# Altium project USB-C_Horizontal_Bridge.PrjPcb
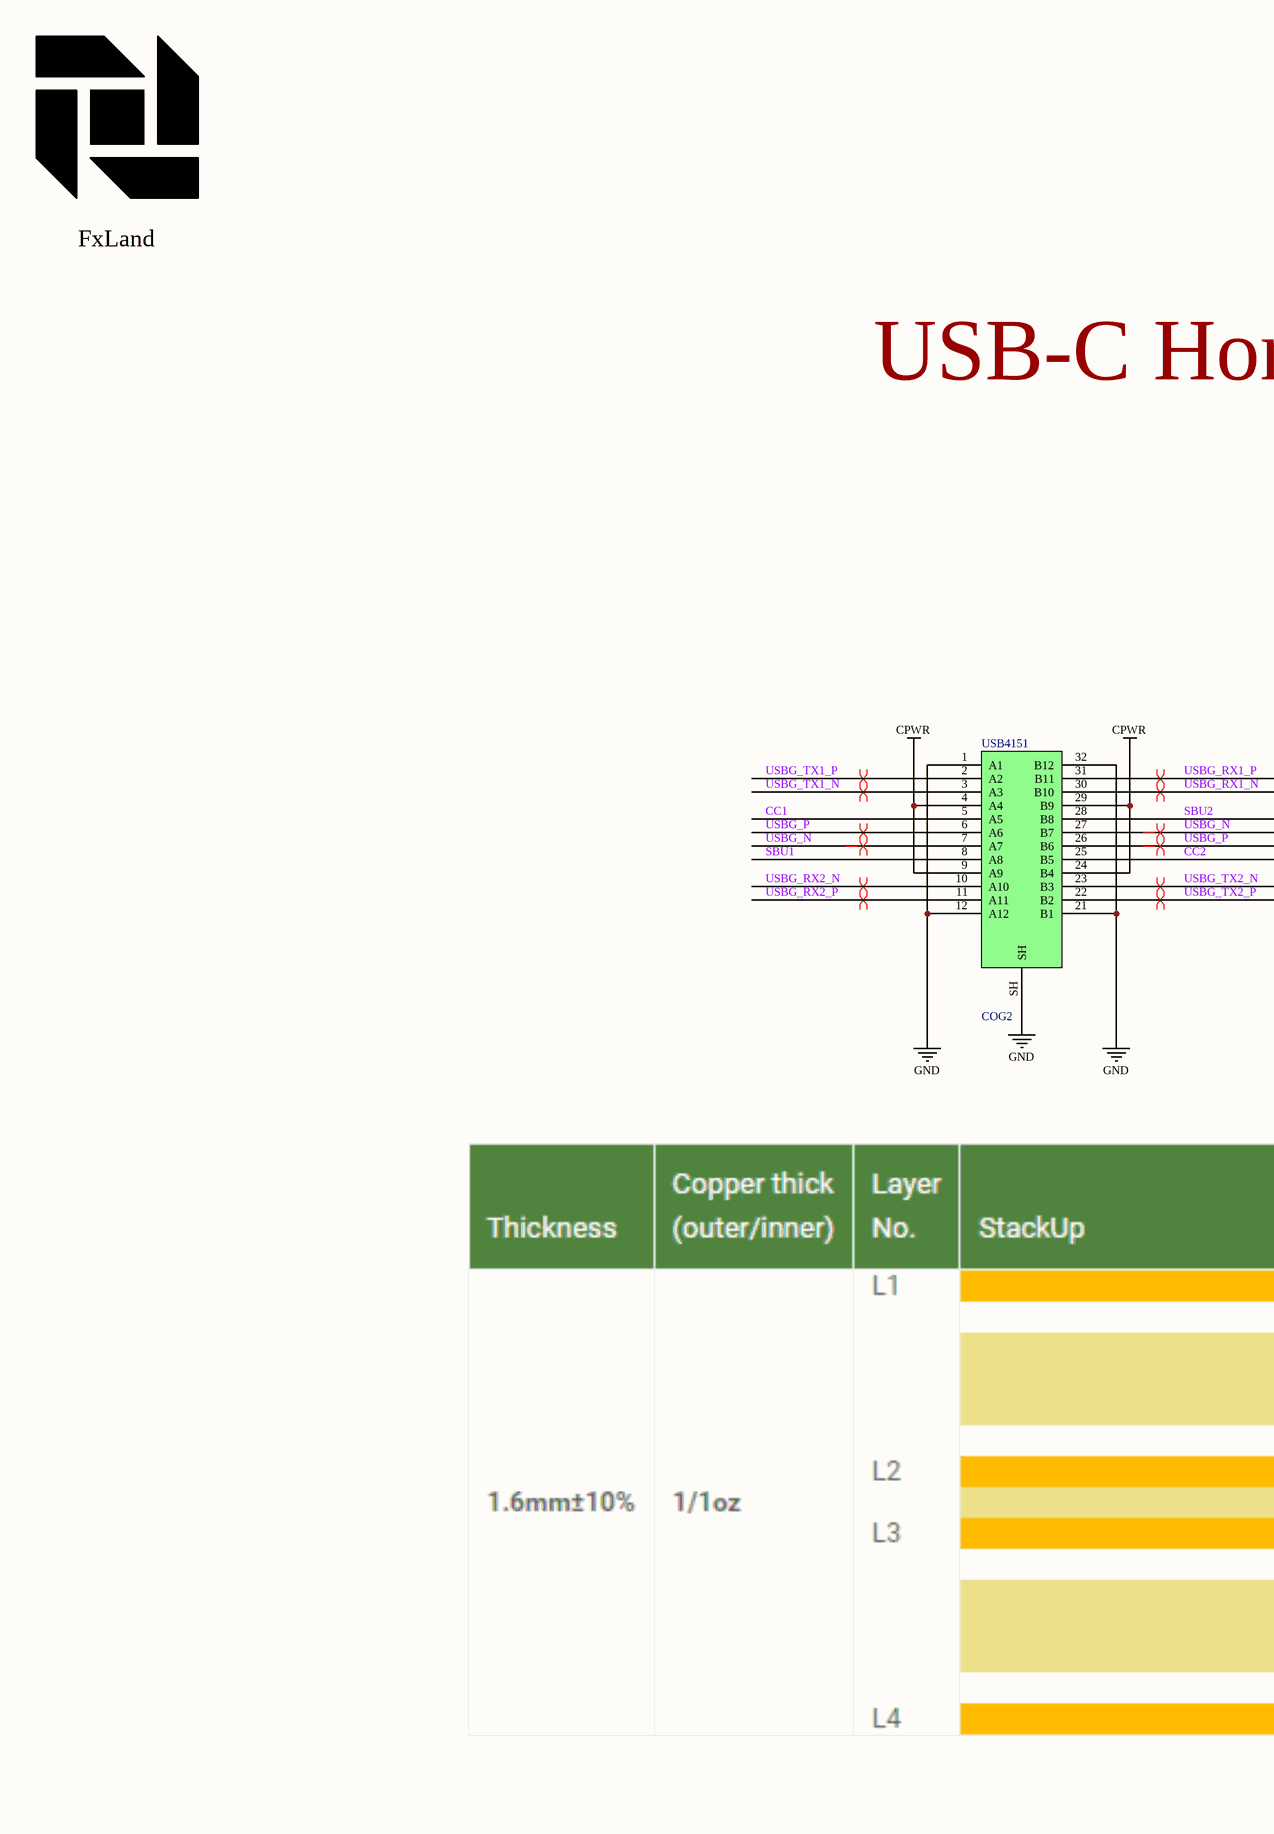
[diagram p0: top.SchDoc, left]
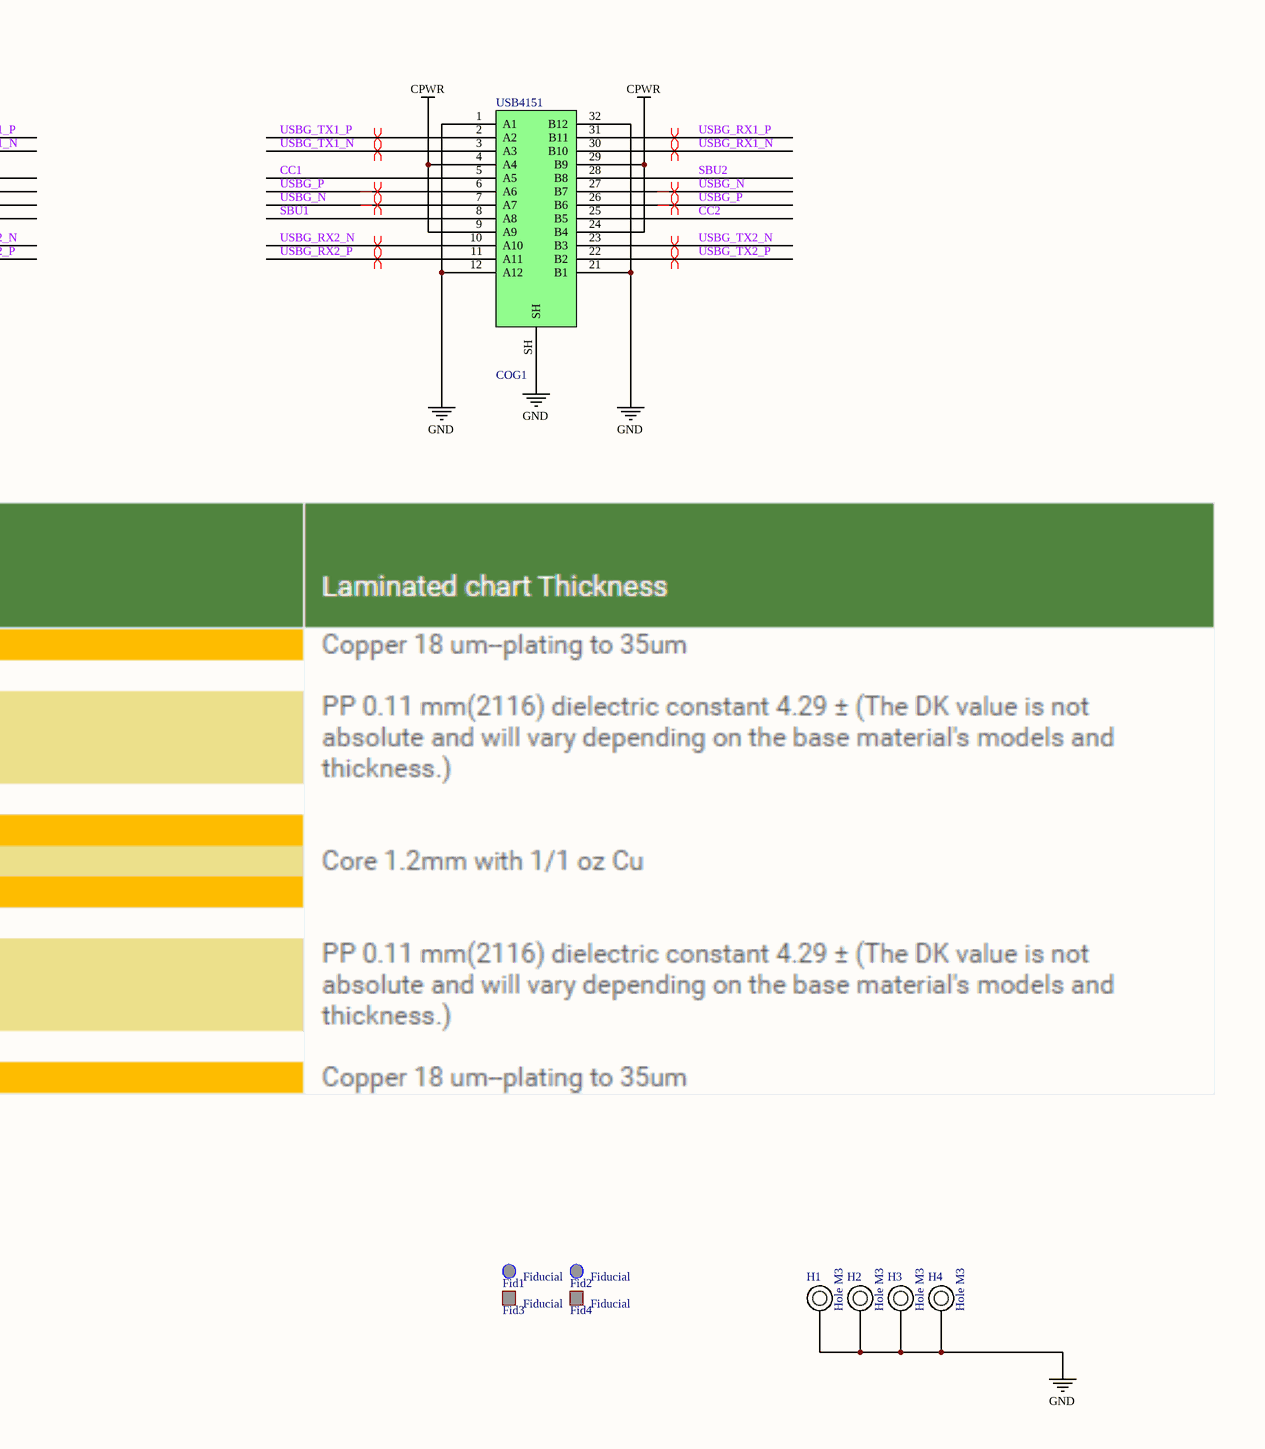
[diagram p1: top.SchDoc, right]
DocNumber: P234; PrName: CM4 Tower Part 1; Rev: 2.1
1 sheet, 11 parts. Net scope: global (net labels, ports and power ports of the same name join across sheets).
Board file: USB-C_Horizontal_Bridge.PcbDoc

## Sheet top.SchDoc: CM4 Tower part 1 Overview
size A2; Organization: Greenfield Tech Solutions; Address1: Molendreef 33; Address2: Ossendrecht; Address3: 4641CS; Address4: The Netherlands; DocumentNumber: P234; Revision: 2.1; SheetNumber: 1; SheetTotal: 1

### Parts
COG1  USB4151  [USB4151-GF-C]
COG2  USB4151  [USB4151-GF-C]
Fid1  Fiducial  [FidR_1.0mm]  (no BOM)
Fid2  Fiducial  [FidR_1.0mm]  (no BOM)
Fid3  Fiducial  [FidS_1.0mm]  (no BOM)
Fid4  Fiducial  [FidS_1.0mm]  (no BOM)
H1  Hole M3  [HOLE_M3]  (no BOM)
H2  Hole M3  [HOLE_M3]  (no BOM)
H3  Hole M3  [HOLE_M3]  (no BOM)
H4  Hole M3  [HOLE_M3]  (no BOM)
Logo_FxLand1  FxLand  [Logo_FxLand_3]  (value not drawn)  (no BOM)

### Nets
CPWR: COG1.4(A4) COG1.9(A9) COG1.24(B4) COG1.29(B9) COG2.4(A4) COG2.9(A9) COG2.24(B4) COG2.29(B9)
GND: COG1.1(A1) COG1.12(A12) COG1.21(B1) COG1.32(B12) COG1.SH COG2.1(A1) COG2.12(A12) COG2.21(B1) COG2.32(B12) COG2.SH H1.1 H2.1 H3.1 H4.1
CC1: COG1.5(A5) COG2.5(A5)
CC2: COG1.25(B5) COG2.25(B5)
SBU1: COG1.8(A8) COG2.8(A8)
SBU2: COG1.28(B8) COG2.28(B8)
USBG_N: COG1.7(A7) COG1.27(B7) COG2.7(A7) COG2.27(B7)
USBG_P: COG1.6(A6) COG1.26(B6) COG2.6(A6) COG2.26(B6)
USBG_RX1_N: COG1.30(B10) COG2.30(B10)
USBG_RX1_P: COG1.31(B11) COG2.31(B11)
USBG_RX2_N: COG1.10(A10) COG2.10(A10)
USBG_RX2_P: COG1.11(A11) COG2.11(A11)
USBG_TX1_N: COG1.3(A3) COG2.3(A3)
USBG_TX1_P: COG1.2(A2) COG2.2(A2)
USBG_TX2_N: COG1.23(B3) COG2.23(B3)
USBG_TX2_P: COG1.22(B2) COG2.22(B2)

### Layout directives
differential pair; differential pair class USB3: USBG_RX1_N, USBG_RX1_P, USBG_RX2_N, USBG_RX2_P, USBG_TX1_N, USBG_TX1_P, USBG_TX2_N, USBG_TX2_P
differential pair; differential pair class USB2: USBG_N, USBG_P

### Notes on the sheet
- USB-C Horizontal Bridge
- Title
- Size:
- Date:
- File:
- A2
- Number:
- Time:
- Revision:
- Sheet
- of

### Library data of the parts
COG1 COG2 = CO0017: USB C connector Plug; Part Number: CO0017; ID: 26; RefVal: USB4151; ManfactPart: USB4151-GF-C
Fid1 Fid2 = ME0011: Fiducial Round 1mm; Part Number: ME0011; ID: 11; RefVal: Fiducial
Fid3 Fid4 = ME0012: Fiducial Sqaure 1mm; Part Number: ME0012; ID: 12; RefVal: Fiducial
H1-H4 = ME0001: Mounting Hole M3; Part Number: ME0001; ID: 1; RefVal: Hole M3
Logo_FxLand1 = ME0008: Logo FxLand 3; Part Number: ME0008; ID: 8; RefVal: FxLand